# EAGLE schematic GPSClockISAsmd (EAGLE 7.7.0)
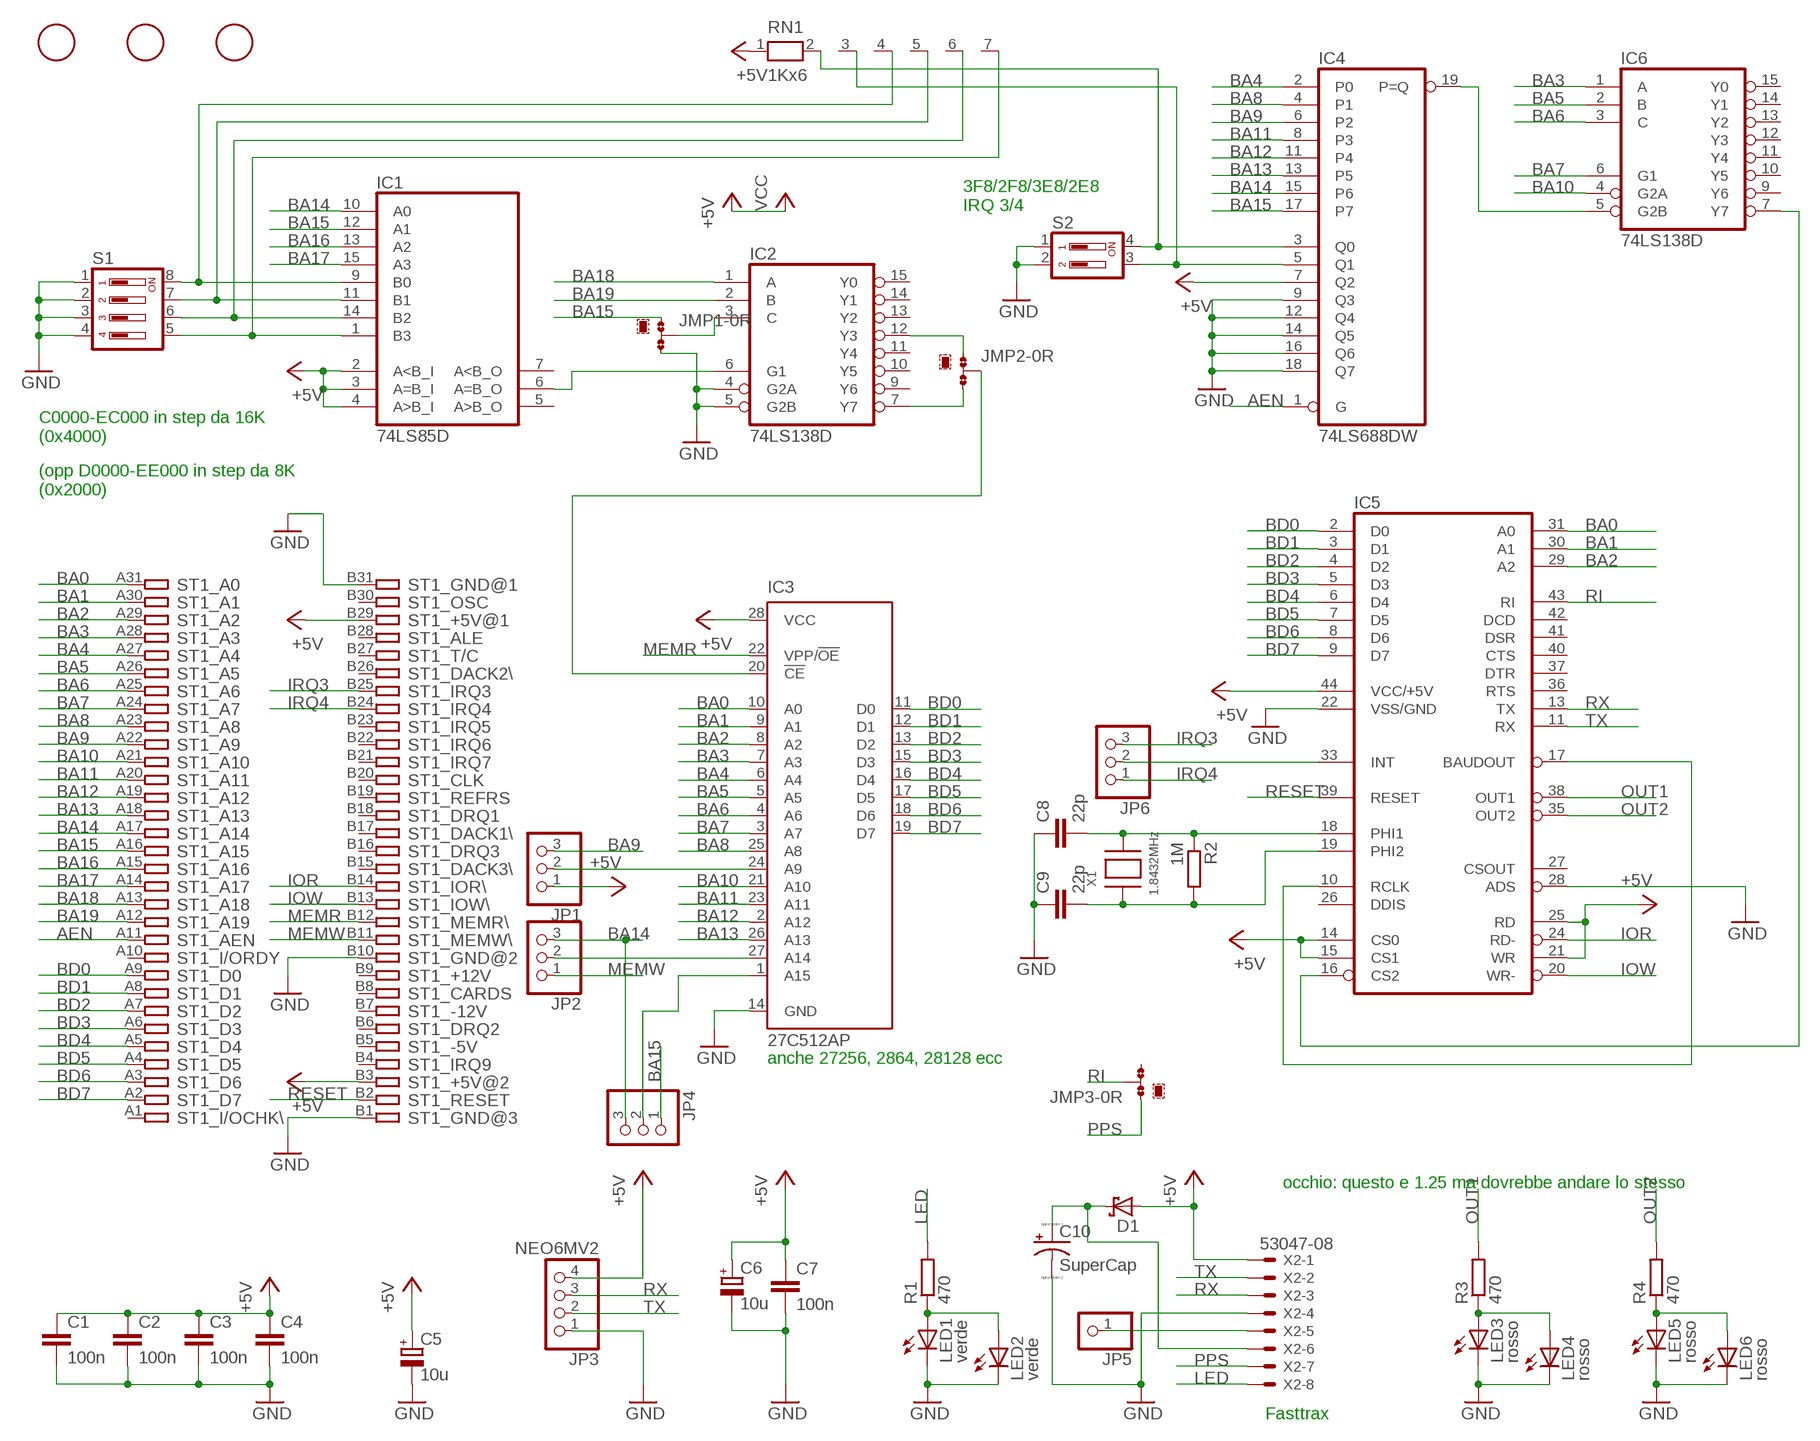
[diagram p0: schematic, sheet 1]

## Parts
C1  100n  C-EUC0805  [C0805]
C2  100n  C-EUC0805  [C0805]
C3  100n  C-EUC0805  [C0805]
C4  100n  C-EUC0805  [C0805]
C5  10u  CPOL-EUSMCD  [SMC_D]
C6  10u  CPOL-EUSMCC  [SMC_C]
C7  100n  C-EUC0805  [C0805]
C8  22p  C-EUC0805  [C0805]
C9  22p  C-EUC0805  [C0805]
C10  SuperCap  CPOL-USE10-22.5  [EB22,5D]
D1  SCHOTTKY-DIODESMC  [SMC]
F1  FIDUCIAL  [FIDUCIAL_1MM]
F2  FIDUCIAL  [FIDUCIAL_1MM]
F3  FIDUCIAL  [FIDUCIAL_1MM]
IC1  74LS85D  [SO16]
IC2  74LS138D  [SO16]
IC3  27C512AP  [DIL28-6]
IC4  74LS688DW  [SO20W]
IC5  8250PLCC  [PLCC44]
IC6  74LS138D  [SO16]
JMP1  0R-JUMPC  [C0R-JMP]
JMP2  0R-JUMPC  [C0R-JMP]
JMP3  0R-JUMPC  [C0R-JMP]
JP1  PINHD-1X03_2.54  [1X03]
JP2  PINHD-1X03_2.54  [1X03]
JP3  NEO6MV2  PINHD-1X4  [1X04]
JP4  PINHD-1X03_2.54  [1X03]
JP5  PINHD-1X1  [1X01]
JP6  PINHD-1X03_2.54  [1X03]
LED1  verde  LEDCHIPLED_0805  [CHIPLED_0805]
LED2  verde  LED3MM  [LED3MM]
LED3  rosso  LEDCHIPLED_0805  [CHIPLED_0805]
LED4  rosso  LED3MM  [LED3MM]
LED5  rosso  LEDCHIPLED_0805  [CHIPLED_0805]
LED6  rosso  LED3MM  [LED3MM]
R1  470  R-EU_R0805  [R0805]
R2  1M  R-EU_R0805  [R0805]
R3  470  R-EU_R0805  [R0805]
R4  470  R-EU_R0805  [R0805]
RN1  1Kx6  RN06  [RN-7]
S1  DIP04YL  [DIP04YL]
S2  DIP02YL  [DIP02YL]
ST1  IBM8BIT  [IBM8BIT]
X1  1.8432MHz  XTALNX8045  [NX8045]
X2  53047-08  [53047-08]

## Nets
+5V [+3V3]: C1.1 C2.1 C3.1 C4.1 C5.+ C6.+ C7.1 D1.A IC1.2(A<B_I) IC1.3(A=B_I) IC1.4(A>B_I) IC3.28(VCC) IC4.7(Q2) IC5.14(CS0) IC5.15(CS1) IC5.21(WR) IC5.25(RD) IC5.44(VCC/+5V) JP1.1 JP3.4 RN1.1 ST1.B3 ST1.B29 X2.1
AEN: IC4.1(G) ST1.A11
BA0: IC3.10(A0) IC5.31(A0) ST1.A31
BA1: IC3.9(A1) IC5.30(A1) ST1.A30
BA2: IC3.8(A2) IC5.29(A2) ST1.A29
BA3: IC3.7(A3) IC6.1(A) ST1.A28
BA4: IC3.6(A4) IC4.2(P0) ST1.A27
BA5: IC3.5(A5) IC6.2(B) ST1.A26
BA6: IC3.4(A6) IC6.3(C) ST1.A25
BA7: IC3.3(A7) IC6.6(G1) ST1.A24
BA8: IC3.25(A8) IC4.4(P1) ST1.A23
BA9: IC4.6(P2) JP1.3 ST1.A22
BA10: IC3.21(A10) IC6.4(G2A) ST1.A21
BA11: IC3.23(A11) IC4.8(P3) ST1.A20
BA12: IC3.2(A12) IC4.11(P4) ST1.A19
BA13: IC3.26(A13) IC4.13(P5) ST1.A18
BA14: IC1.10(A0) IC4.15(P6) JP2.3 JP4.3 ST1.A17
BA15: IC1.12(A1) IC4.17(P7) JMP1.1 JP4.1 ST1.A16
BA16: IC1.13(A2) ST1.A15
BA17: IC1.15(A3) ST1.A14
BA18: IC2.1(A) ST1.A13
BA19: IC2.2(B) ST1.A12
BD0: IC3.11(D0) IC5.2(D0) ST1.A9
BD1: IC3.12(D1) IC5.3(D1) ST1.A8
BD2: IC3.13(D2) IC5.4(D2) ST1.A7
BD3: IC3.15(D3) IC5.5(D3) ST1.A6
BD4: IC3.16(D4) IC5.6(D4) ST1.A5
BD5: IC3.17(D5) IC5.7(D5) ST1.A4
BD6: IC3.18(D6) IC5.8(D6) ST1.A3
BD7: IC3.19(D7) IC5.9(D7) ST1.A2
GND [N3]: C1.2 C2.2 C3.2 C4.2 C5.- C6.- C7.2 C8.1 C9.1 C10.- IC2.4(G2A) IC2.5(G2B) IC3.14(GND) IC4.9(Q3) IC4.12(Q4) IC4.14(Q5) IC4.16(Q6) IC4.18(Q7) IC5.22(VSS/GND) IC5.28(ADS) JMP1.3 JP3.1 LED1.C LED2.K(C) LED3.C LED4.K(C) LED5.C LED6.K(C) S1.1 S1.2 S1.3 S1.4 S2.1 S2.2 ST1.B1 ST1.B10 ST1.B31 X2.4
IOR: IC5.24(RD-) ST1.B14
IOW: IC5.20(WR-) ST1.B13
IRQ3: JP6.3 ST1.B25
IRQ4: JP6.1 ST1.B24
LED: R1.2 X2.8
MEMR: IC3.22(VPP/!OE) ST1.B12
MEMW: JP2.1 ST1.B11
N$1: JP5.1 X2.5
N$2: LED3.A LED4.A R3.1
N$3: LED5.A LED6.A R4.1
N$4: IC1.9(B0) RN1.4 S1.8
N$5 [+3V3]: C10.+ D1.C X2.6
N$6: IC1.11(B1) RN1.5 S1.7
N$7: IC5.33(INT) JP6.2
N$8: IC1.14(B2) RN1.6 S1.6
N$9: LED1.A LED2.A R1.1
N$10: IC1.1(B3) RN1.7 S1.5
N$11: IC2.12(Y3) JMP2.1
N$12: IC4.19(P=Q) IC6.5(G2B)
N$13: IC3.20(!CE) JMP2.2
N$14: IC5.10(RCLK) IC5.17(BAUDOUT)
N$15: C9.2 IC5.19(PHI2) R2.2 X1.P$1
N$16: IC3.27(A14) JP2.2
N$17: C8.2 IC5.18(PHI1) R2.1 X1.P$2
N$18: IC2.3(C) JMP1.2
N$19: IC3.1(A15) JP4.2
N$20: IC4.5(Q1) RN1.3 S2.3
N$21: IC4.3(Q0) RN1.2 S2.4
N$22: IC3.24(A9) JP1.2
N$23: IC1.6(A=B_O) IC2.6(G1)
N$24: IC2.7(Y7) JMP2.3
N$25: IC5.16(CS2) IC6.7(Y7)
OUT1: IC5.38(OUT1) R3.2
OUT2: IC5.35(OUT2) R4.2
PPS: JMP3.1 X2.7
RESET: IC5.39(RESET) ST1.B2
RI: IC5.43(RI) JMP3.2
RX: IC5.13(TX) JP3.3 X2.3
TX: IC5.11(RX) JP3.2 X2.2
Unconnected: IC1.5(A>B_O) IC1.7(A<B_O) IC2.9(Y6) IC2.10(Y5) IC2.11(Y4) IC2.13(Y2) IC2.14(Y1) IC2.15(Y0) IC5.26(DDIS) IC5.27(CSOUT) IC5.36(RTS) IC5.37(DTR) IC5.40(CTS) IC5.41(DSR) IC5.42(DCD) IC6.9(Y6) IC6.10(Y5) IC6.11(Y4) IC6.12(Y3) IC6.13(Y2) IC6.14(Y1) IC6.15(Y0) JMP3.3 ST1.A1 ST1.A10 ST1.B4 ST1.B5 ST1.B6 ST1.B7 ST1.B8 ST1.B9 ST1.B15 ST1.B16 ST1.B17 ST1.B18 ST1.B19 ST1.B20 ST1.B21 ST1.B22 ST1.B23 ST1.B26 ST1.B27 ST1.B28 ST1.B30

## Notes on the sheet
- 3F8/2F8/3E8/2E8
  IRQ 3/4
- C0000-EC000 in step da 16K
  (0x4000)
- (opp D0000-EE000 in step da 8K
  (0x2000)
- anche 27256, 2864, 28128 ecc
- occhio: questo e 1.25 ma dovrebbe andare lo stesso
- Fasttrax

## Power pins joined to a net without a drawn wire
GND: IC1.8(GND) IC2.8(GND) IC4.10(GND) IC6.8(GND)
VCC: IC1.16(VCC) IC2.16(VCC) IC4.20(VCC) IC6.16(VCC)

## Library data of the parts
C1-C4 C7-C9 = resistor:C-EU: CAPACITOR, European symbol
C5 C6 = resistor:CPOL-EU: POLARIZED CAPACITOR, European symbol
C10 = resistor:CPOL-US: POLARIZED CAPACITOR, American symbol
D1 = diode:SCHOTTKY-DIODE: Schottky Diode
F1-F3 = adafruit:FIDUCIAL: For use by pick and place machines to calibrate the vision/machine, 1mm By microbuilder.eu
IC1 = 74xx-eu:74*85: 4-bit magnitude COMPARATOR
IC2 IC6 = 74xx-eu:74*138: 3-line to 8-line DECODER/DEMULTIPLEXER
IC3 = microchip2:27*512A: CMOS EPROM 512 K (64 K x 8); MPN: M27C512-90B6; OC_FARNELL: 1642690; OC_NEWARK: 20M6389
IC4 = 74xx-eu:74*688: 8-bit MAGNITUDE/IDENTITY COMPARATOR, totem pole
IC5 = micro-intel:8250: 8250 UART
JMP1-JMP3 = jump-0r-smd:0R-JUMP: SMD 0R 0805 Jumper
JP1 JP2 JP4 JP6 = pinhead-2:PINHD-1X03: PIN HEADER
JP3 = pinhead:PINHD-1X4: PIN HEADER
JP5 = pinhead:PINHD-1X1: PIN HEADER
LED1 LED3 LED5 = led:LED: LED
LED2 LED4 LED6 = adafruit:LED: LED
R1-R4 = resistor:R-EU_: RESISTOR, European symbol
RN1 = resistor-net:RN06: RESISTOR NETWORK; OC_FARNELL: unknown; OC_NEWARK: unknown
S1 = switch-dil:DIP04YL: DIL/CODE SWITCH; OC_FARNELL: unknown; OC_NEWARK: unknown
S2 = switch-dil:DIP02YL: DIL/CODE SWITCH; OC_FARNELL: unknown; OC_NEWARK: unknown
ST1 = con-pc:IBM8BIT: 8-bit CARD IBM/PC-AT
X1 = adafruit:XTAL: Low cost SMT crystals, no capacitors included http://www.ladyada.net/library/eagle
X2 = con-molex:53?-08: CONNECTOR wire to board 1.25 mm (.049 inch) pitch header; MPN: 53047-0810; OC_FARNELL: 1012258; OC_NEWARK: 98K9826

## Net classes
1 +3V3: width 0.508 mm, clearance 0.152 mm
2 N2: width 0.762 mm, clearance 0.762 mm
3 N3: width 0.508 mm
4 GND: width 0.508 mm, clearance 0.152 mm